# EAGLE design Dreamcast (EAGLE 9.6.2)
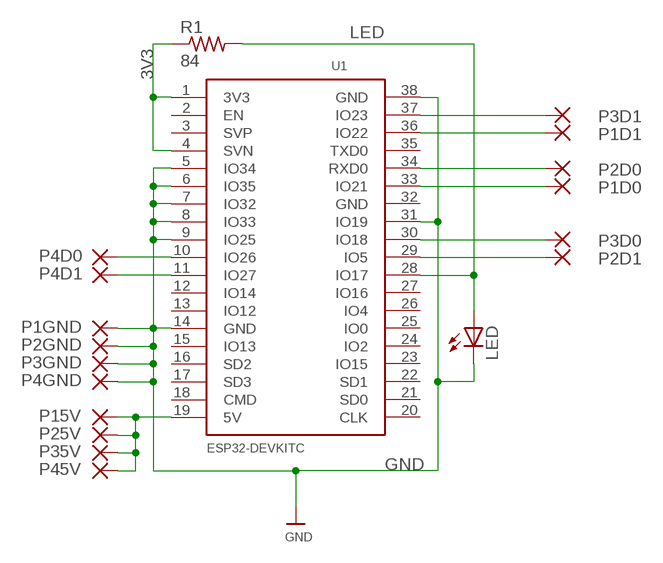
[diagram p0: schematic, sheet 1]

## Parts
LED  LEDCHIPLED_1206  [CHIPLED_1206]
P1D0  SMD5  [SMD2,54-5,08]
P1D1  SMD5  [SMD2,54-5,08]
P1GND  SMD5  [SMD2,54-5,08]
P2D0  SMD5  [SMD2,54-5,08]
P2D1  SMD5  [SMD2,54-5,08]
P2GND  SMD5  [SMD2,54-5,08]
P3D0  SMD5  [SMD2,54-5,08]
P3D1  SMD5  [SMD2,54-5,08]
P3GND  SMD5  [SMD2,54-5,08]
P4D0  SMD5  [SMD2,54-5,08]
P4D1  SMD5  [SMD2,54-5,08]
P4GND  SMD5  [SMD2,54-5,08]
P15V  SMD5  [SMD2,54-5,08]
P25V  SMD5  [SMD2,54-5,08]
P35V  SMD5  [SMD2,54-5,08]
P45V  SMD5  [SMD2,54-5,08]
R1  84  R-US_R1206  [R1206]
U1  ESP32DEVKITC  [ESP32-DEVKITC]

## Nets
3V3: R1.1 U1.1(3V3) U1.4(SVN)
5V: P15V.1(P) P25V.1(P) P35V.1(P) P45V.1(P) U1.19(5V)
GND: LED.C P1GND.1(P) P2GND.1(P) P3GND.1(P) P4GND.1(P) U1.5(IO34) U1.6(IO35) U1.7(IO32) U1.8(IO33) U1.9(IO25) U1.14(GND) U1.31(IO19) U1.38(GND)
LED: LED.A R1.2 U1.28(IO17)
P1D0: P1D0.1(P) U1.33(IO21)
P1D1: P1D1.1(P) U1.36(IO22)
P2D0: P2D0.1(P) U1.34(RXD0)
P2D1: P2D1.1(P) U1.29(IO5)
P3D0: P3D0.1(P) U1.30(IO18)
P3D1: P3D1.1(P) U1.37(IO23)
P4D0: P4D0.1(P) U1.10(IO26)
P4D1: P4D1.1(P) U1.11(IO27)
Unconnected: U1.2(EN) U1.3(SVP) U1.12(IO14) U1.13(IO12) U1.15(IO13) U1.16(SD2) U1.17(SD3) U1.18(CMD) U1.20(CLK) U1.21(SD0) U1.22(SD1) U1.23(IO15) U1.24(IO2) U1.25(IO0) U1.26(IO4) U1.27(IO16) U1.32(GND) U1.35(TXD0)

## Library data of the parts
LED = adafruit:LED: LED OSRAM: - CHIPLED LG R971, LG N971, LY N971, LG Q971, LY Q971, LO R971, LY R971 LH N974, LH R974 LS Q976, LO Q976, LY Q976 LO Q996 - Hyper CHIPLED LW Q18S LB Q993, LB Q99A, LB R99A - SideLED LS A670, LO A670, LY A670, LG A670, LP A670 LB A673, LV A673, LT A673, LW A673 LH A674 LY A675 LS A676, LA A676, LO A676, LY A676, LW A676 LS A679, LY A679, LG A679 - Hyper Micro SIDELED® LS Y876, LA Y876, LO Y876, LY Y876 LT Y87S - SmartLED LW L88C, LW L88S LB L89C, LB L89S, LG L890 LS L89K, LO L89K, LY L89K LS L896, LA L896, LO L896, LY L896 - TOPLED LS T670, LO T670, LY T670, LG T670, LP T670 LSG T670, LSP T670, LSY T670, LOP T670, LYG T670 LG T671, LOG T671, LSG T671 LB T673, LV T673, LT T673, LW T673 LH T674 LS T676, LA T676, LO T676, LY T676, LB T676, LH T676, LSB T676, LW T676 LB T67C, LV T67C, LT T67C, LS T67K, LO T67K, LY T67K, LW E67C LS E67B, LA E67B, LO E67B, LY E67B, LB E67C, LV E67C, LT E67C LW T67C LS T679, LY T679, LG T679 LS T770, LO T770, LY T770, LG T770, LP T770 LB T773, LV T773, LT T773, LW T773 LH T774 LS E675, LA E675, LY E675, LS T675 LS T776, LA T776, LO T776, LY T776, LB T776 LHGB T686 LT T68C, LB T68C - Hyper Mini TOPLED® LB M676 - Mini TOPLED Santana® LG M470 LS M47K, LO M47K, LY M47K Source: http://www.osram.convergy.de/
P1D0 P1D1 P1GND P2D0 P2D1 P2GND P3D0 P3D1 P3GND P4D0 P4D1 P4GND P15V P25V P35V P45V = wirepad:SMD5: SMD PAD
R1 = adafruit:R-US_: RESISTOR, American symbol
U1 = ESP32-DEVKITC:ESP32DEVKITC

## Board
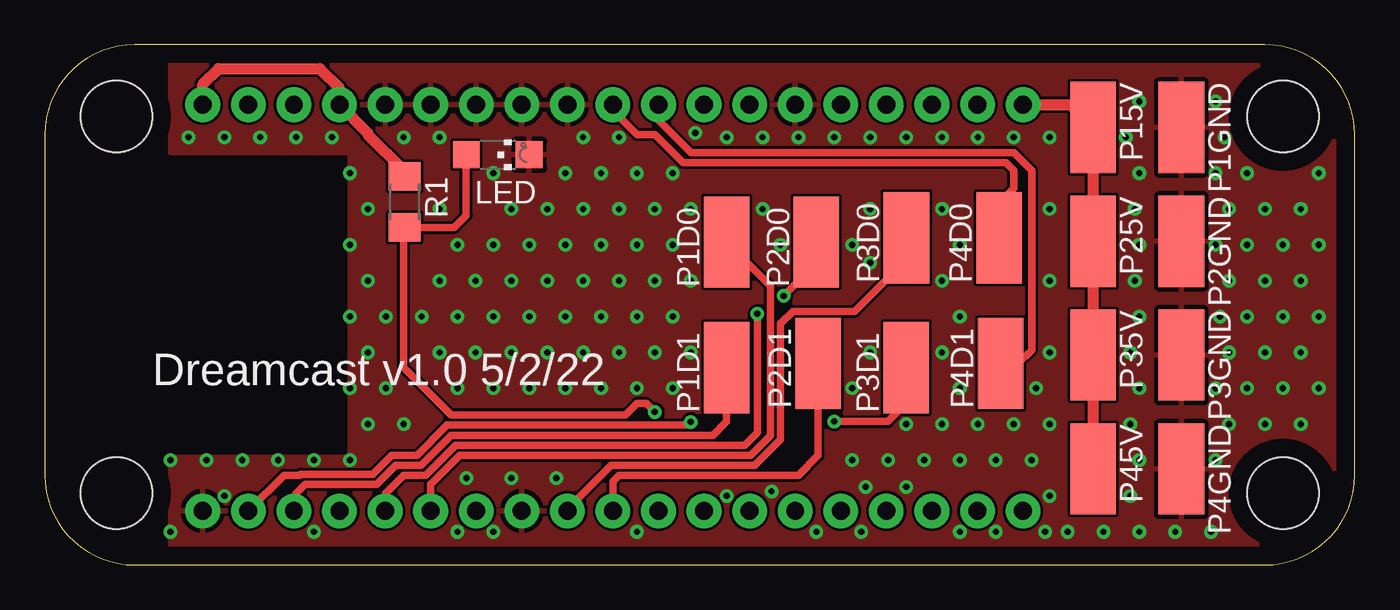
[diagram p1: board, top side]
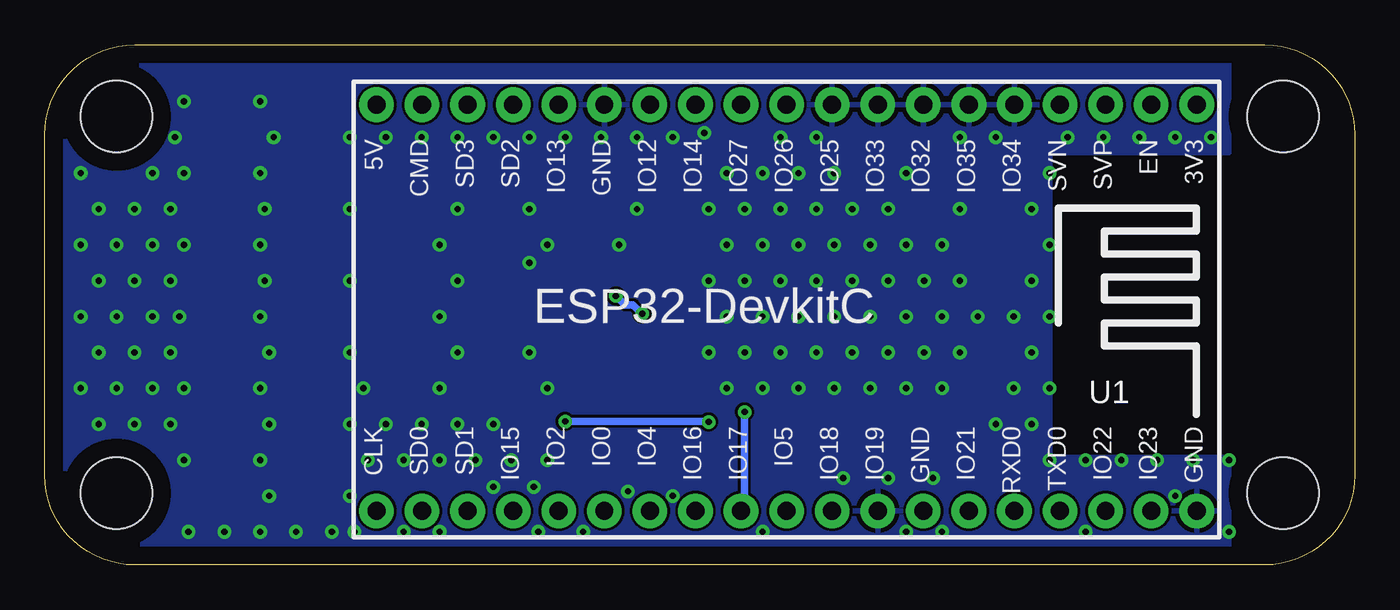
[diagram p2: board, bottom side, seen from below]

Size 73 x 29 mm. Coordinates in mm from the lower left corner, seen from the top.
Outline: 0,24 0,5 arc90 5,0 68,0 arc90 73,5 73,24 arc90 68,29 5,29 arc90 0,24
Copper layers (1*16): Top 0.035mm / dielectric 1.5mm / Bottom 0.035mm
Design rules "default": minimum track width 6mil, minimum drill 0.35mm, track to track 6mil, track to pad 6mil, pad to pad 6mil, via to via 6mil, smd to smd 6mil, copper to edge 40mil, drill to drill 6mil, minimum pad ring 10mil, minimum via ring 8mil, stop-mask expansion 4mil, vias tented up to drill 0.5mm, thermal gap 10mil
Holes 4 mm at 4,4 4,25 69,25 69,4

### Footprints (pad centres in the part's own frame; a part is rotated, then mirrored left to right if it is on the bottom)
CHIPLED_1206 = smd 1.5 x 1.5: A 0,-1.75; C 0,1.75
SMD2,54-5,08 = smd 2.54 x 5.08: 1 0,0
R1206 = smd 1.6 x 1.803: 1 -1.422,0; 2 1.422,0
ESP32-DEVKITC = drill 1 pad 1.93: 1 -22.87,-11.42; 2 -20.33,-11.42; 3 -17.79,-11.42; 4 -15.25,-11.42; 5 -12.71,-11.42; 6 -10.17,-11.42; 7 -7.63,-11.42; 8 -5.09,-11.42; 9 -2.55,-11.42; 10 -0.01,-11.42; 11 2.53,-11.42; 12 5.07,-11.42; 13 7.61,-11.42; 14 10.15,-11.42; 15 12.69,-11.42; 16 15.23,-11.42; 17 17.77,-11.42; 18 20.31,-11.42; 19 22.85,-11.42; 20 22.85,11.23; 21 20.31,11.23; 22 17.77,11.23; 23 15.23,11.23; 24 12.69,11.23; 25 10.15,11.23; 26 7.61,11.23; 27 5.07,11.23; 28 2.53,11.23; 29 -0.01,11.23; 30 -2.55,11.23; 31 -5.09,11.23; 32 -7.63,11.23; 33 -10.17,11.23; 34 -12.71,11.23; 35 -15.25,11.23; 36 -17.79,11.23; 37 -20.33,11.23; 38 -22.87,11.23

### Placement (x,y rotation side)
LED  25.24,22.87 270 top
P1D0  38,18 0 top
P1D1  38,11 0 top
P1GND  63.34,24.4 180 top
P2D0  43,18 0 top
P2D1  43.1,11.24 0 top
P2GND  63.34,18.05 180 top
P3D0  48.02,18.24 0 top
P3D1  48,11 0 top
P3GND  63.34,11.7 180 top
P4D0  53.18,18.24 0 top
P4D1  53.26,11.24 0 top
P4GND  63.34,5.35 180 top
P15V  58.42,24.4 180 top
P25V  58.42,18.05 180 top
P35V  58.42,11.7 180 top
P45V  58.42,5.35 180 top
R1  20.05,20.24 270 top
U1  31.67,14.24 180 bottom

### Tracks (layer width: path | path; a pad name or v marks a point on that pad's centre or on a via)
3V3
  Top 0.61: U1.1 8.8,26.8 9.68,27.68 15.32,27.68 16.42,26.58 U1.4 18,24.08 18,24 20.05,21.95 R1.1
5V
  Top 0.61: U1.19 57.16,25.66 P15V.1 P25V.1 P35V.1 P45V.1
GND  (via drill 0.35)
  other vias: 7,1.85 7,5.85 9,5.85 8,23.85 10,3.85 11,5.85 10,23.85 13,5.85 12,23.85 15,1.85 15,5.85 14,23.85 17,5.85 17,9.85 17,13.85 17,17.85 17,21.85 16,23.85 18,7.85 19,9.85 18,11.85 19,13.85 18,15.85 18,19.85 20,7.85 21,13.85 20,23.85 23,1.85 23,9.85 22,11.85 23,13.85 22,15.85 23,17.85 22,19.85 22,23.85 25,1.85 25,9.85 24,11.85 25,13.85 24,15.85 25,17.85 25,21.85 27,9.85 26,11.85 27,13.85 26,15.85 27,17.85 26,19.85 23.5,4.85 29,9.85 28,11.85 29,13.85 28,15.85 29,17.85 28,19.85 29,21.85 26,4.85 31,9.85 30,11.85 31,13.85 30,15.85 31,17.85 30,19.85 31,21.85 30,23.85 33,1.85 33,9.85 32,11.85 33,13.85 32,15.85 33,17.85 32,19.85 33,21.85 32,23.85 28.5,4.85 35,9.85 34,11.85 35,13.85 34,15.85 35,17.85 34,19.85 35,21.85 36,11.85 36,15.85 36,19.85 36.25,24.1 38,3.85 38,23.85 40.5,4.1 41,17.85 40,19.85 40,23.85 43,1.85 42,23.85 45.5,1.85 45,5.85 45,9.85 45,17.85 44,23.85 45.75,4.35 47,5.85 46,11.85 46,16.85 46,19.85 46,23.85 48,4.35 49,5.85 48,7.85 48,23.85 51,1.85 51,5.85 50,7.85 51,9.85 50,11.85 51,13.85 50,15.85 51,17.85 50,19.85 50,23.85 53,1.85 53,5.85 52,7.85 52,23.85 55.75,1.85 55,5.85 54,7.85 55.25,9.85 54,23.85 57,1.85 56,3.85 56,7.85 56,11.85 56,15.85 56,19.85 56,23.85 59,1.85 61,1.85 60.5,3.85 61,5.85 60.5,7.85 61,9.85 60.5,11.85 61,13.85 60.75,15.85 61,17.85 60.75,19.85 61,21.85 60.25,23.85 61,25.85 63,1.85 65,1.85 65.25,5.85 65.25,9.85 65.5,13.85 65.25,17.85 65.25,21.85 65.25,25.85 66,7.85 67,9.85 66,11.85 67,13.85 66,15.85 67,17.85 66,19.85 67,21.85 65.75,23.85 68,7.85 69,9.85 68,11.85 69,13.85 68,15.85 69,17.85 68,19.85 70,7.85 71,9.85 70,11.85 71,13.85 70,15.85 71,17.85 70,19.85 71,21.85
  pour Top: 7,29 7,23 17,23 17,6 7,6 7,0 73,0 73,29
  pour Bottom: 7,0 73,0 73,29 7,29 7,23 17,23 17,6 7,6
LED  (via drill 0.35)
  Top 0.406: LED.A 23.49,19.49 22.82,18.82 R1.2 20,18.77 20,11 22.65,8.35 32.35,8.35 33,9 33.53,9 v34,8.53
  Bottom 0.406: U1.28 34,3.21 v34,8.53
P1D0
  Top 0.406: U1.33 21.5,4.5 23.12,6.12 39.33,6.12 40.44,7.23 40.44,15.56 P1D0.1
P1D1
  Top 0.406: U1.36 14,3.13 14,4 14.5,4.5 18.5,4.5 19.56,5.56 20.98,5.56 22.66,7.24 37.23,7.24 38,8 P1D1.1
P2D0  (via drill 0.35)
  Top 0.406: U1.34 19,3.05 19,4 20,5 21.21,5 22.89,6.68 39,6.68 39.71,7.38 v39.71,14 | v41.17,15 43,16.82 P2D0.1
  Bottom 0.406: v39.71,14 40.21,14.5 40.67,14.5 v41.17,15
P2D1
  Top 0.406: U1.29 31.66,4.66 32,5 42,5 43.1,6.1 P2D1.1
P3D0
  Top 0.406: U1.30 29.12,3.12 31.56,5.56 39.56,5.56 41,7 41,13.45 41.68,14.14 45.14,14.14 48.02,17.02 P3D0.1
P3D1  (via drill 0.35)
  Top 0.406: U1.37 13.33,5 14.21,5 14.27,5.06 18.27,5.06 19.33,6.12 20.75,6.12 22.42,7.79 35.83,7.79 v36,7.97 | v44,8 47,8 48,9 P3D1.1
  Bottom 0.406: v36,7.97 36.03,8 v44,8
P4D0
  Top 0.406: P4D0.1 53.18,20.18 54,21 54,22 53.56,22.44 35.56,22.44 34,24 33,24 31.66,25.34 U1.10
P4D1
  Top 0.406: P4D1.1 54.24,11.24 55,12 55,22 54,23 36,23 34.2,24.8 U1.11

### Text on the board
tNames: Dreamcast v1.0 5/2/22